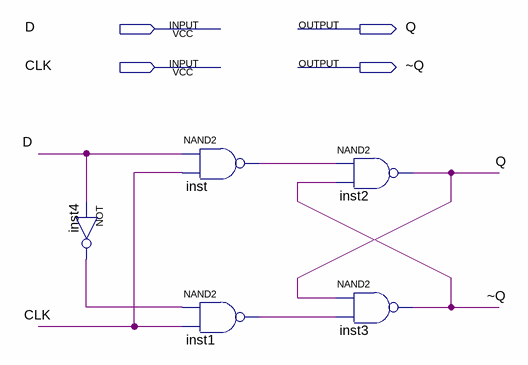
[diagram p0: schematic sheet]
// Quartus schematic FLIP_FLOP_D.bdf as structural Verilog: 5 symbols, 4 pins
module FLIP_FLOP_D (
  input  D,
  input  CLK,
  output Q,
  output \~Q 
);

  wire inst1_out, inst4_out, inst_out;

  not inst4 (inst4_out, D);
  nand inst (inst_out, D, CLK);
  nand inst1 (inst1_out, inst4_out, CLK);
  nand inst2 (Q, inst_out, \~Q );
  nand inst3 (\~Q , Q, inst1_out);
endmodule
